# EAGLE design SimulatorT2SecondPCRevA (EAGLE 7.7.0)
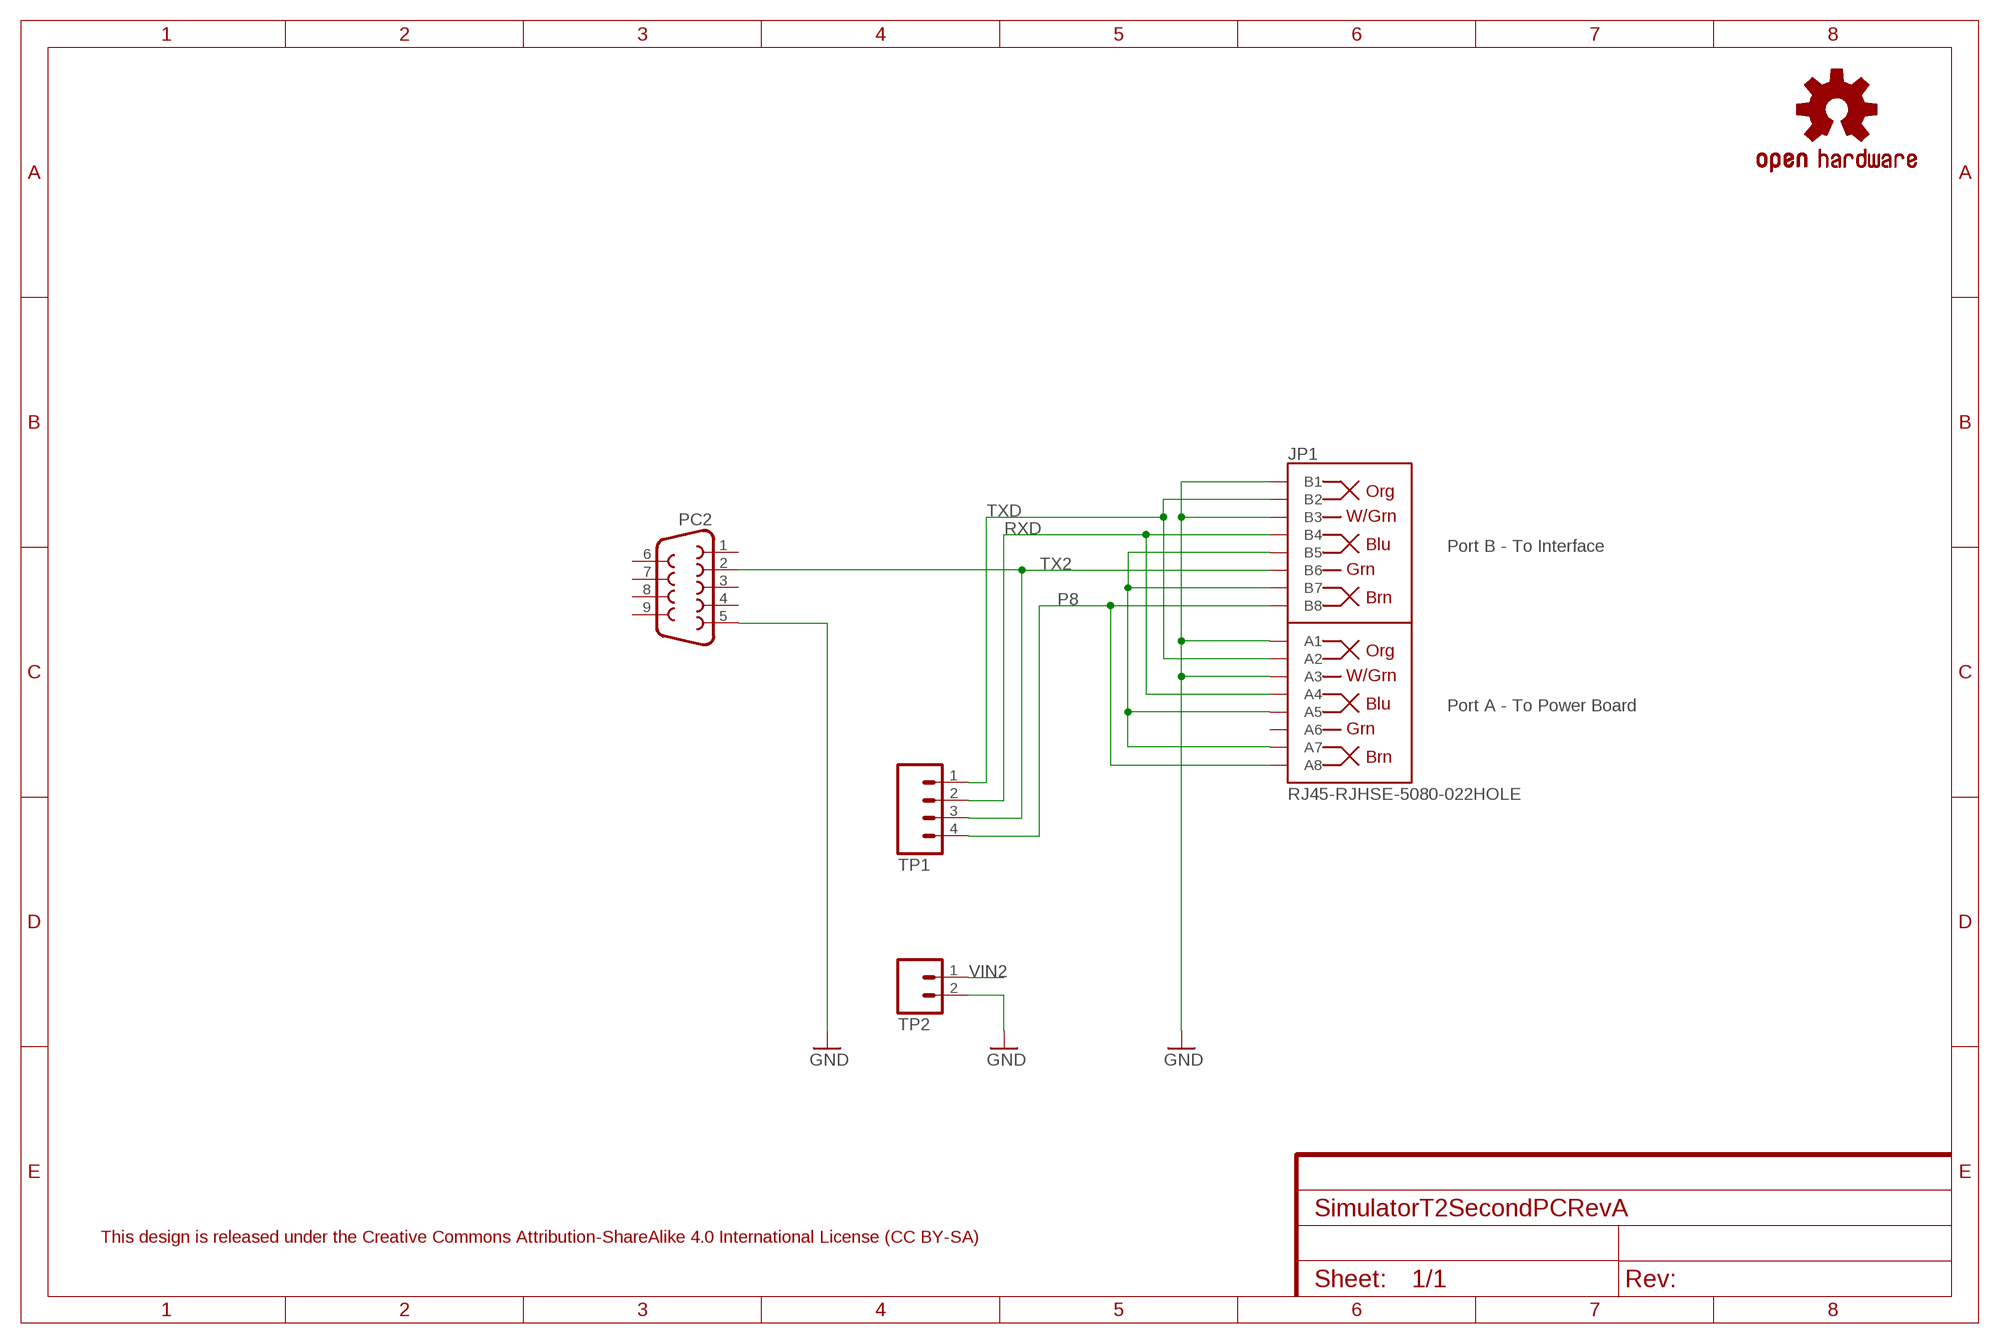
[diagram p0: schematic, sheet 1]
FRAME1 (FRAME-A4L): CNAME: Simulator Type 2 Second PC; CREVISION: Rev A 04/2019; DESIGNER: A J Instone-Cowie

## Parts
JP1  RJ45-RJHSE-5080-022HOLE  [RJ45-RJHSE-5080-02]
LOGO1  OSHW-LOGOS  [OSHW-LOGO-S]
PC2  DB9-CONNECTOR-PCBFEMALE  [MULTICOMP-DB9-FEMALE-PCB-90DEG]
TP1  M04PTH  [1X04]
TP2  M02PTH  [1X02]

## Nets
GND: JP1.A1 JP1.A3 JP1.B1 JP1.B3 PC2.5 TP2.2
P8: JP1.A8 JP1.B8 TP1.4
RXD: JP1.A4 JP1.B4 TP1.2
TX2: JP1.B6 PC2.2 TP1.3
TXD: JP1.A2 JP1.B2 TP1.1
VIN2: JP1.A5 JP1.A7 JP1.B5 JP1.B7 TP2.1
Unconnected: JP1.A6 PC2.1 PC2.3 PC2.4 PC2.6 PC2.7 PC2.8 PC2.9

## Notes on the sheet
- Port B - To Interface
- Port A - To Power Board
- This design is released under the Creative Commons Attribution-ShareAlike 4.0 International License (CC BY-SA)

## Library data of the parts
JP1 = AIC_Custom:RJ45-RJHSE-5080-02: Amphenol RJHSE-x080 RJ45 PCB Jack (2-Port) RJ45 8-pin connection PCB PTH connector, 2-Port 90 degree package 3 Hole variant has extra hole to allow a single port socket to fitted to position A if position B is not required.
LOGO1 = SparkFun-Aesthetics:OSHW-LOGO: Open Source Hardware Logo This logo indicates the piece of hardware it is found on incorporates a OSHW license and/or adheres to the definition of open source hardware found here: http://freedomdefined.org/OSHW
PC2 = AIC_Custom:DB9-CONNECTOR-PCB: DB9 Connector Multicomp PCB Right-Angle DB9 Connector Female 5504F1-09S-02A-03
TP1 = SparkFun-Connectors:M04: Header 4 Standard 4-pin 0.1" header. Use with straight break away headers (SKU : PRT-00116), right angle break away headers (PRT-00553), swiss pins (PRT-00743), machine pins (PRT-00117), and female headers (PRT-00115). Molex polarized connector foot print use with SKU : PRT-08231 with associated crimp pins and housings. 1MM SMD Version SKU: PRT-10208
TP2 = SparkFun-Connectors:M02: Standard 2-pin 0.1" header. Use with - straight break away headers ( PRT-00116) - right angle break away headers (PRT-00553) - swiss pins (PRT-00743) - machine pins (PRT-00117) - female headers (PRT-00115) Molex polarized connector foot print use with: PRT-08233 with associated crimp pins and housings. 2.54_SCREWTERM for use with PRT-10571. 3.5mm Screw Terminal footprints for PRT-08084 5mm Screw Terminal footprints for use with PRT-08432

## Board
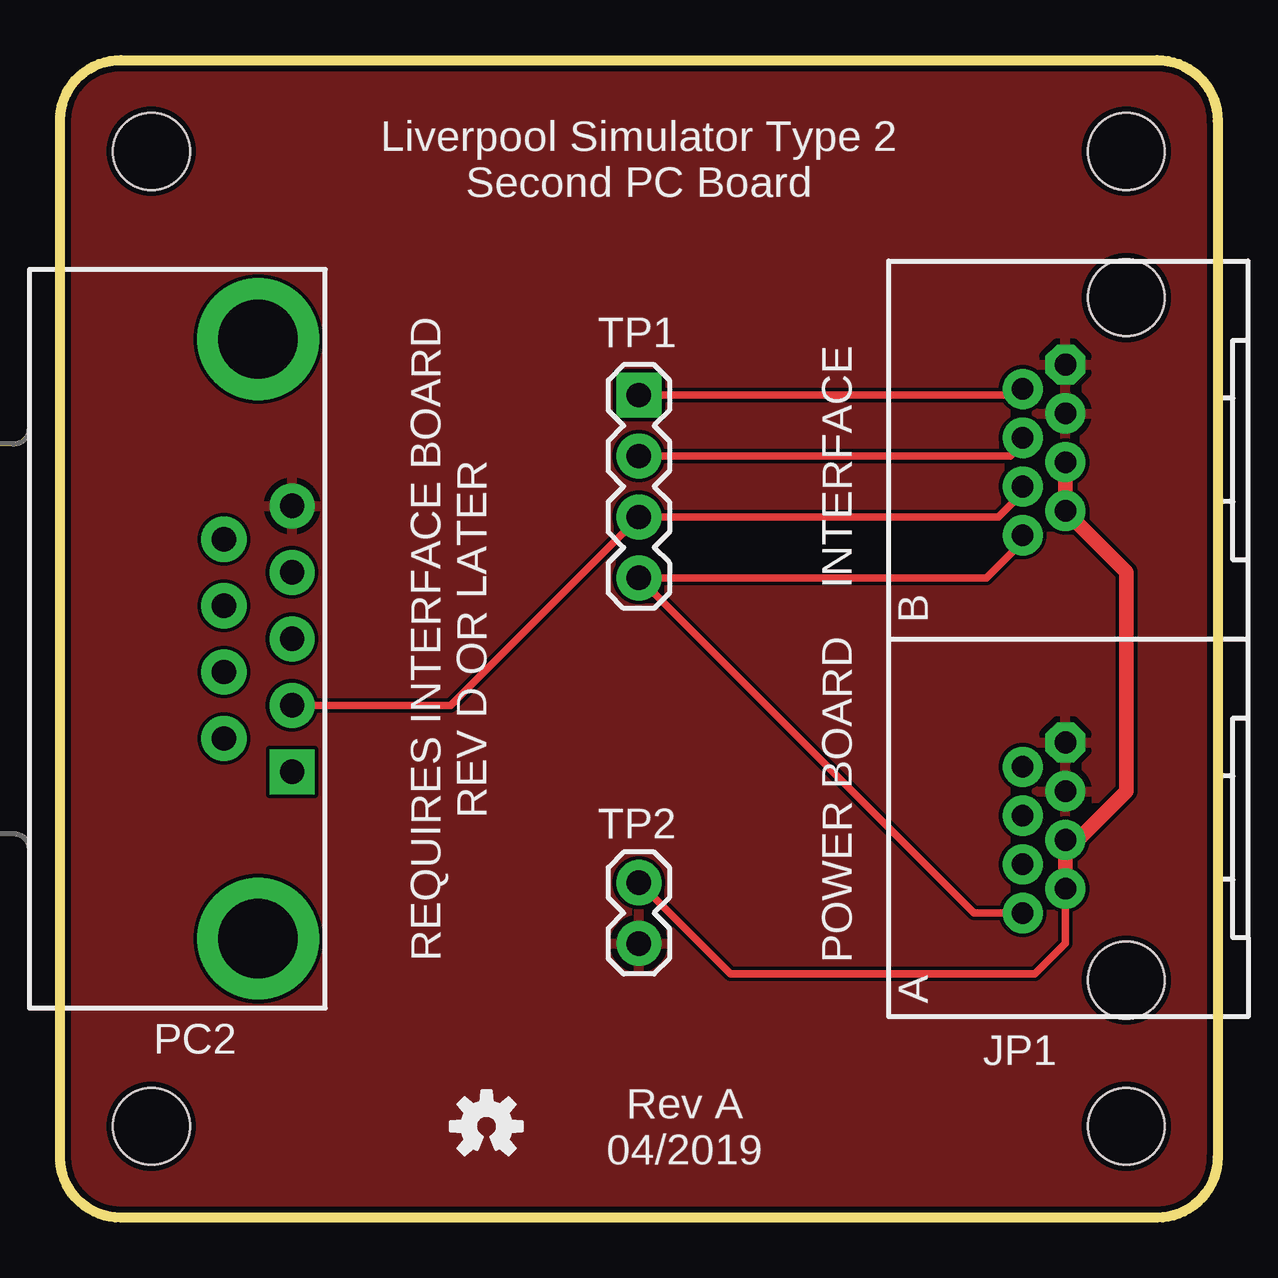
[diagram p1: board, top side]
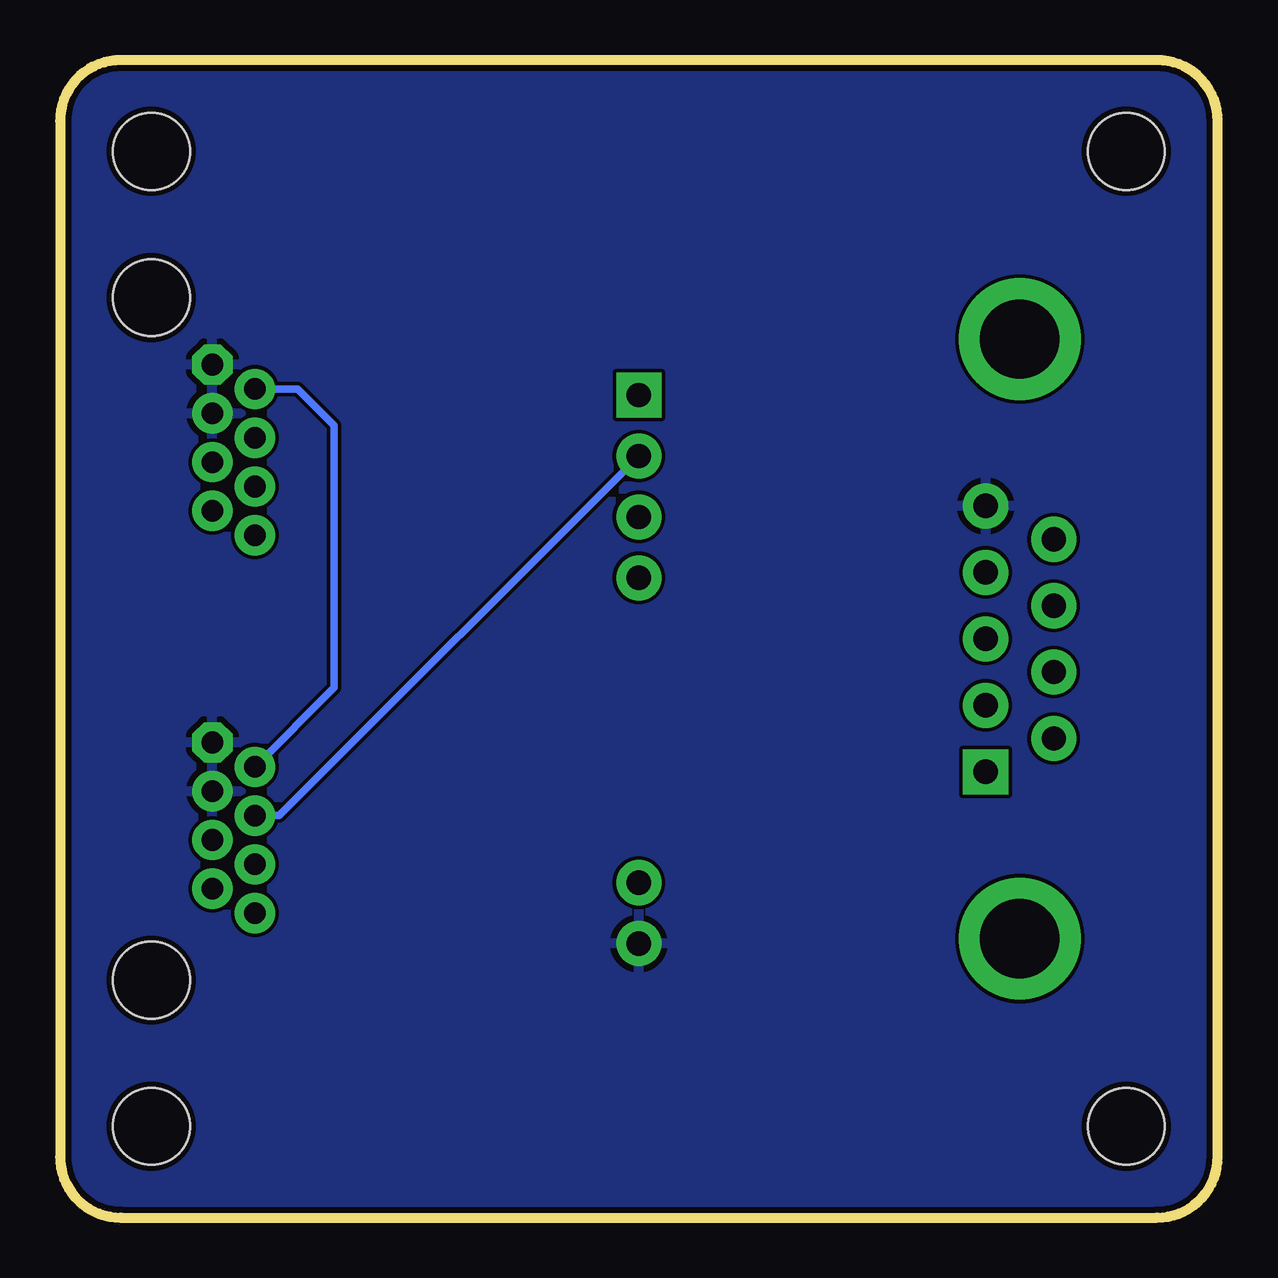
[diagram p2: board, bottom side, seen from below]

Size 48.26 x 48.26 mm. Coordinates in mm from the lower left corner, seen from the top.
Outline: 0,2.54 0,45.72 arc-90 2.54,48.26 45.72,48.26 arc-90 48.26,45.72 48.26,2.54 arc-90 45.72,0 2.54,0 arc-90 0,2.54
Copper layers (1*16): Top 0.035mm / dielectric 1.5mm / Bottom 0.035mm
Design rules "SeeedStudio_2layer_DRU_no_angle_20140221": minimum track width 6mil, minimum drill 12mil, track to track 6mil, track to pad 6mil, pad to pad 6mil, via to via 6mil, smd to smd 0mil, copper to edge 10mil, drill to drill 10mil, minimum pad ring 10mil, minimum via ring 6mil, stop-mask expansion 2mil, vias tented up to drill 100mil, thermal gap 10mil
Holes 3.2 mm at 3.81,3.81 3.81,44.45 44.45,44.45 44.45,3.81

### Footprints (pad centres in the part's own frame; a part is rotated, then mirrored left to right if it is on the bottom)
RJ45-RJHSE-5080-02 = drill 0.9 pad 1.676 octagon: A1 -4.318,2.54; B1 11.43,2.54 | drill 0.9 pad 1.676: A2 -5.334,4.318; A3 -6.35,2.54; A4 -7.366,4.318; A5 -8.382,2.54; A6 -9.398,4.318; A7 -10.414,2.54; A8 -11.43,4.318; B2 10.414,4.318; B3 9.398,2.54; B4 8.382,4.318; B5 7.366,2.54; B6 6.35,4.318; B7 5.334,2.54; B8 4.318,4.318 | hole 3.2: -14.224,0; 14.224,0
MULTICOMP-DB9-FEMALE-PCB-90DEG = drill 1.016 pad 1.88 square: 1 -5.54,-10.945 | drill 1.016 pad 1.88: 2 -2.77,-10.945; 3 0,-10.945; 4 2.77,-10.945; 5 5.54,-10.945; 6 -4.15,-8.105; 7 -1.38,-8.105; 8 1.38,-8.105; 9 4.15,-8.105 | drill 3.302 pad 5.08: G1 -12.496,-9.525; G2 12.496,-9.525
1X04 = drill 1.016 pad 1.88 square: 1 0,0 | drill 1.016 pad 1.88: 2 2.54,0; 3 5.08,0; 4 7.62,0
1X02 = drill 1.016 pad 1.88: 1 0,0; 2 2.54,0

### Placement (x,y rotation side)
JP1  44.45,24.13 90 top
LOGO1  17.78,3.81 0 top
PC2  -1.27,24.13 90 top
TP1  24.13,34.29 270 top
TP2  24.13,13.97 270 top

### Tracks (layer width: path | path; a pad name or v marks a point on that pad's centre or on a via)
GND
  pour Bottom: 2.54,48.26 45.72,48.26 arc-90 48.26,45.72 48.26,2.54 arc-90 45.72,0 2.54,0 arc-90 0,2.54 0,45.72 arc-90
  pour Top: 2.54,48.26 45.72,48.26 arc-90 48.26,45.72 48.26,2.54 arc-90 45.72,0 2.54,0 arc-90 0,2.54 0,45.72 arc-90
P8
  Top 0.305: JP1.B8 40.13,28.19 38.61,26.67 TP1.4 38.1,12.7 JP1.A8
RXD
  Top 0.305: TP1.2 39.62,31.75 40.13,32.26 JP1.B4
  Bottom 0.305: JP1.A4 39.12,16.76 TP1.2
TX2
  Top 0.305: JP1.B6 40.13,30.23 39.12,29.21 TP1.3 16.28,21.36 PC2.2
TXD
  Top 0.305: TP1.1 39.88,34.29 JP1.B2
  Bottom 0.305: JP1.B2 38.35,34.54 36.83,33.02 36.83,22.1 JP1.A2
VIN2
  Top 0.305: TP2.1 27.94,10.16 40.64,10.16 41.91,11.43 JP1.A7
  Top 0.406: 42.42,15.75 JP1.A5
  Top 0.61: JP1.B5 JP1.B7 44.45,26.92 44.45,17.78 42.42,15.75 | JP1.A5 JP1.A7

### Text on the board
tPlace: Liverpool Simulator Type 2 / Second PC Board | REQUIRES INTERFACE BOARD / REV D OR LATER | POWER BOARD INTERFACE | Rev A / 04/2019